# Altium schematic sheet WallBaseBoard.SchDoc: WallBaseBoard
size A3; Author: eldar6776@hotmail.com; DrawnBy: Eldar Dedic; Organization: I-MEDIA GROUP d.o.o.; Address1: Osman Topal Paše 18; Address2: 71000 Sarajevo; Address3: Federacija BiH; Address4: Bosna i Hercegovina; DocumentNumber: DE-030426; Revision: 001; SheetNumber: 1; SheetTotal: 1; SPICEModelCacheBVBUIEPD: <root> / <DocumentId>BVBUIEPD</DocumentId> / </root>
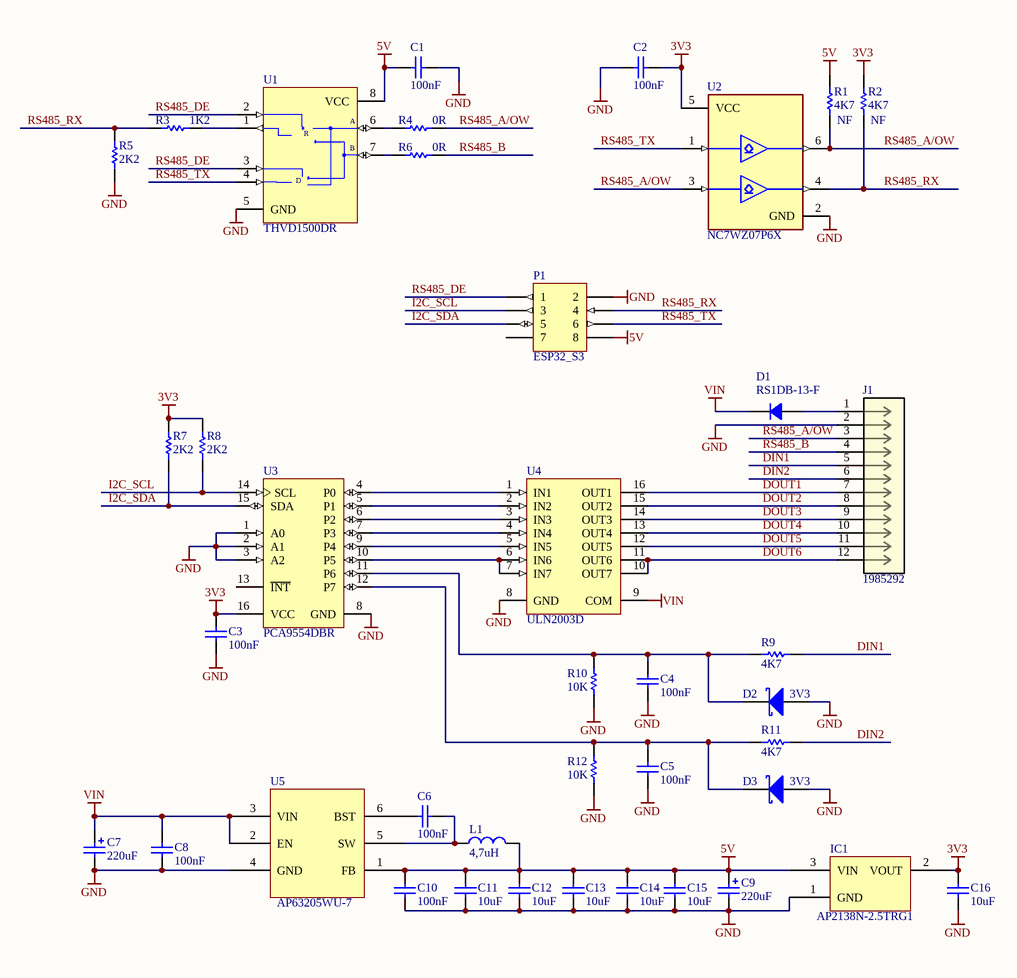
[diagram p0: WallBaseBoard.SchDoc]

## Parts
C1  100nF  [0603]
C2  100nF  [0603]
C3  100nF  [0603]
C4  100nF  [0603]
C5  100nF  [0603]
C6  100nF  [0603]
C7  220uF  [SMD,D8xL10.2mm]
C8  100nF  [0603]
C9  value 220uF  [SMD,D6.3xL7.7mm Aluminum Electrolytic Capacitors]  (hidden comment: ROQANG VT1C221M0607_1)
C10  100nF  [0603]
C11  value 10uF  [0805]  (hidden comment: 4u7)
C12  value 10uF  [0805]  (hidden comment: 4u7)
C13  value 10uF  [0805]  (hidden comment: 4u7)
C14  value 10uF  [0805]  (hidden comment: 4u7)
C15  value 10uF  [0805]  (hidden comment: 4u7)
C16  value 10uF  [0805]  (hidden comment: 4u7)
D1  RS1DB-13-F  [DO214AA SMB]
D2  3V3  [SOD323]
D3  3V3  [SOD323]
IC1  AP2138N-2.5TRG1  [DIODES SOT-23-3 N]
J1  1985292  [CONN_1985292_PXC]
L1  value 4,7uH  [XRNR4030-4.7uH/M]  (hidden comment: Inductor)
P1  ESP32_S3  [HDR2X4]
R1  NF  value 4K7  [ERA-0603]
R2  NF  value 4K7  [ERA-0603]
R3  value 1K2  [ERA-0603]  (hidden comment: 10K)
R4  value 0R  [ERA-0603]  (hidden comment: 10K)
R5  value 2K2  [ERA-0603]  (hidden comment: 10K)
R6  value 0R  [ERA-0603]  (hidden comment: 10K)
R7  value 2K2  [ERA-0603]  (hidden comment: 10K)
R8  value 2K2  [ERA-0603]  (hidden comment: 10K)
R9  value 4K7  [ERA-0603]  (hidden comment: 10K)
R10  10K  [ERA-0603]
R11  value 4K7  [ERA-0603]  (hidden comment: 10K)
R12  10K  [ERA-0603]
U1  THVD1500DR  [NSO8_N]
U2  NC7WZ07P6X  [FP-419AD-01-MFG]
U3  PCA9554DBR  [SSOP-16]
U4  ULN2003D  [SO16_N]
U5  AP63205WU-7  [TSOT-26]

## Nets
3V3: C2.1 C3.2 C16.2 IC1.2(VOUT) R2.2 R7.2 R8.2 U2.5(VCC) U3.16(VCC)
5V: C1.2 C9.1 C10.2 C11.2 C12.2 C13.2 C14.2 C15.2 IC1.3(VIN) L1.1 P1.8 R1.2 U1.8(VCC) U5.1(FB)
GND: C1.1 C2.2 C3.1 C4.1 C5.1 C7.2 C8.1 C9.2 C10.1 C11.1 C12.1 C13.1 C14.1 C15.1 C16.1 D2.2(A) D3.2(A) IC1.1(GND) J1.2 P1.2 R5.1 R10.1 R12.1 U1.5(GND) U2.2(GND) U3.1(A0) U3.2(A1) U3.3(A2) U3.8(GND) U4.8(GND) U5.4(GND)
VIN: C7.1 C8.2 D1.2 U4.9(COM) U5.2(EN) U5.3(VIN)
DIN1: J1.5 R9.1
DIN2: J1.6 R11.1
DOUT1: J1.7 U4.16(OUT1)
DOUT2: J1.8 U4.15(OUT2)
DOUT3: J1.9 U4.14(OUT3)
DOUT4: J1.10 U4.13(OUT4)
DOUT5: J1.11 U4.12(OUT5)
DOUT6: J1.12 U4.10(OUT7) U4.11(OUT6)
I2C_SCL: P1.3 R8.1 U3.14(SCL)
I2C_SDA: P1.5 R7.1 U3.15(SDA)
RS485_A/OW: J1.3 R1.1 R4.2 U2.3(A2) U2.6(Y1)
RS485_B: J1.4 R6.2
RS485_DE: P1.1 U1.2(~{RE}) U1.3(DE)
RS485_RX: P1.4 R2.1 R3.1 R5.2 U2.4(Y2)
RS485_TX: P1.6 U1.4(DI) U2.1(A1)
NetC4_2: C4.2 D2.1(K) R9.2 R10.2 U3.11(P6)
NetC5_2: C5.2 D3.1(K) R11.2 R12.2 U3.12(P7)
NetC6_1: C6.1 U5.6(BST)
NetC6_2: C6.2 L1.2 U5.5(SW)
NetD1_1: D1.1 J1.1
NetR3_2: R3.2 U1.1(RO)
NetR4_1: R4.1 U1.6(A)
NetR6_1: R6.1 U1.7(B)
NetU3_4: U3.4(P0) U4.1(IN1)
NetU3_5: U3.5(P1) U4.2(IN2)
NetU3_6: U3.6(P2) U4.3(IN3)
NetU3_7: U3.7(P3) U4.4(IN4)
NetU3_9: U3.9(P4) U4.5(IN5)
NetU3_10: U3.10(P5) U4.6(IN6) U4.7(IN7)

Not connected (* = marked no-connect by the designer): P1 7; U3 13(~{INT})

## Notes on the sheet
- Title
- Size:
- Date:
- A3
- Number:
- Time:
- Revision:
- Sheet
- of
- File:
- (in symbol MAX485ESA) R; D

## Library data of the parts
C1-C6 C8 C10 = C0603: Ceramic Chip Capacitor - Standard; Note: Footprint corresponds to dimensions for bulk cassette packaging. This case size has tightened tolerances.; Published: 17-Jul-2002; LatestRevisionDate: 19-Mar-2004; LatestRevisionNote: Silkscreen size reduced.; DatasheetDocument: Mar-2001; PackageDocument: Mar-2001; PackageReference: 0603; Publisher: Altium Limited; Code_JEITA: 0603; Code_IPC: 1608 [0603]; ComponentLink1Description: Manufacturer Link; ComponentLink1URL: http://www.kemet.com/; ComponentLink2Description: Datasheet; ComponentLink2URL: http://www.kemet.com/kemet/web/homepage/kechome.nsf/vapubfilesname/F3102TA.pdf/$file/F3102TA.pdf; Value: 100nF
C7 = ROQANG VT1V221M0810: 220uF 35V 195mA@120Hz ±20% SMD,D8xL10.2mm Aluminum Electrolytic Capacitors - SMD ROHS; Note: Refer to Manufacturer's Data Sheets for other lead formations; DrillSize: Nominal, Rounded To The Nearest 0.1mm; Published: 19-Mar-2004; DatasheetDocument: 20-Feb-2001; PackageReference: CAPPR2-5X11; Publisher: Altium Limited; ComponentLink1Description: Manufacturer Link; ComponentLink1URL: http://www.vishay.com/; ComponentLink2Description: Datasheet; ComponentLink2URL: http://www.vishay.com/docs/25014/eka.pdf; Value: 220uF
C9 = ROQANG VT1C221M0607_1: 220uF 16V 110mA@120Hz ±20% SMD,D6.3xL7.7mm Aluminum Electrolytic Capacitors - SMD ROHS; Note: Refer to Manufacturer's Data Sheets for other lead formations; DrillSize: Nominal, Rounded To The Nearest 0.1mm; Published: 19-Mar-2004; DatasheetDocument: 20-Feb-2001; PackageReference: CAPPR2-5X11; Publisher: Altium Limited; ComponentLink1Description: Manufacturer Link; ComponentLink1URL: http://www.vishay.com/; ComponentLink2Description: Datasheet; ComponentLink2URL: http://www.vishay.com/docs/25014/eka.pdf
C11-C16 = C0805: Ceramic Chip Capacitor - Standard; Note: Footprint corresponds to dimensions for bulk cassette packaging. This case size has tightened tolerances.; Published: 17-Jul-2002; LatestRevisionDate: 19-Mar-2004; LatestRevisionNote: Silkscreen size reduced.; DatasheetDocument: Mar-2001; PackageDocument: Mar-2001; PackageReference: 0805; Publisher: Altium Limited; Code_JEITA: 0805; Code_IPC: 2012[0805]; ComponentLink1Description: Manufacturer Link; ComponentLink1URL: http://www.kemet.com/; ComponentLink2Description: Datasheet; ComponentLink2URL: http://www.kemet.com/kemet/web/homepage/kechome.nsf/vapubfilesname/F3102TA.pdf/$file/F3102TA.pdf
D1 = RS1DB-13-F: DIODE STANDARD 200V 1A SMB; Manufacturer: Diodes Incorporated; Capacitance @ Vr, F: 15pF @ 4V, 1MHz; Current - Reverse Leakage @ Vr: 5 µA @ 200 V; Reverse Recovery Time (trr): 150 ns; Speed: Fast Recovery =< 500ns, > 200mA (Io); Voltage - Forward (Vf) (Max) @ If: 1.3 V @ 1 A; Part Number: RS1DB-13-F; ComponentLink1Description: Datasheet; ComponentLink1URL: https://www.diodes.com/assets/Datasheets/ds15002.pdf; ComponentLink2Description: DigiKey Link; ComponentLink2URL: https://www.digikey.com/en/products/detail/diodes-incorporated/RS1DB-13-F/814459; Current - Average Rectified (Io): 1A; Diode Type: Standard; LastUpdated: 3. 4. 2026. 20:33:12; Lifecycle Status: Active; Minimum Order: 1; Mounting Type: Surface Mount; Operating Temperature - Junction: -65°C ~ 150°C; Package / Case: DO-214AA, SMB; Packaging: TapeAndReel; PartId: 28; Part Status: Active; Price: 0.06; Series: -; Supplier 1: DigiKey; Supplier Part Number 1: RS1DB-FDICT-ND; Supplier Device Package: SMB; Voltage - DC Reverse (Vr) (Max): 200 V
D2 D3 = 1PS76SB10: Schottky Barrier Diode; Published: 17-Sep-2003; LatestRevisionDate: 19-Mar-2004; LatestRevisionNote: Silkscreen size reduced.; DatasheetVersion: 14-Oct-1996; PackageVersion: May-1999; PackageReference: SOD323; Publisher: Altium Limited; PackageDescription: SOD-323/SC-76; 2 Leads; Body 1.7 x 1.3 mm, (LxW); ComponentLink1Description: Manufacturer Link; ComponentLink1URL: http://www.semiconductors.philips.com/; ComponentLink2Description: Datasheet; ComponentLink2URL: http://www.semiconductors.philips.com/acrobat/datasheets/1PS76SB10_2.pdf
IC1 = AP2138N-2.5TRG1: IC REG LINEAR 2.5V 250MA SOT23-3; Manufacturer: Diodes Incorporated; Current - Quiescent (Iq): 1.5 µA; Number of Regulators: 1; Output Configuration: Positive; Output Type: Fixed; Protection Features: Over Current; Voltage Dropout (Max): 1V @ 250mA; Voltage - Input (Max): 6V; Part Number: AP2138N-2.5TRG1; ComponentLink1Description: Datasheet; ComponentLink1URL: https://www.diodes.com/assets/Datasheets/AP2138-9.pdf; ComponentLink2Description: DigiKey Link; ComponentLink2URL: https://www.digikey.com/en/products/detail/diodes-incorporated/AP2138N-2-5TRG1/4470803; Current - Output: 250mA; LastUpdated: 3. 4. 2026. 21:07:40; Lifecycle Status: Active; Minimum Order: 1; Mounting Type: Surface Mount; Operating Temperature: -40°C ~ 85°C (TA); Package / Case: TO-236-3, SC-59, SOT-23-3; Packaging: TapeAndReel; Part Status: Active; Price: 0.08; Series: -; Supplier 1: DigiKey; Supplier Part Number 1: AP2138N-2.5TRG1DICT-ND; Supplier Device Package: SOT-23-3; Voltage - Output (Min/Fixed): 2.5V
J1 = 1985292: PCB terminal block, nominal current: 8 A, nom. voltage: 400 V, pitch: 3.5 mm, number of positions: 12, connection method: Push-in spring connection, mounting: Wave soldering, conductor/PCB connection direction: 45 Â°, color: green. Offset soldering legs, two-rowed; Manufacturer_Name: Phoenix Contact; Copyright: Copyright (C) 2026 Ultra Librarian. All rights reserved.; Manufacturer_Part_Number: 1985292; RefDes: RefDes; Type: Type
L1 = Inductor: 2A 4.7uH Magnetic Adhesive Inductor ±20% 2.9A SMD-2P,4x4mm Power Inductors ROHS
P1 = Header 4X2: Header, 4-Pin, Dual row; LatestRevisionDate: 17-Jul-2002; LatestRevisionNote: Re-released for DXP Platform.; Publisher: Altium Limited
R1-R12 = ERAV: Metal Film Thermosensitive Chip Resistor, 0.56 Ohm to 10k Ohm Range, 5% Tolerance, 0603 Size, 0.063 W; Note: If flow soldering, adjust pad width of PCB Footprint to 0.7 - 0.8 times the width of the resistor.; Published: 17-Dec-2003; LatestRevisionDate: 19-Mar-2004; LatestRevisionNote: Silkscreen size reduced.; PackageDocument: Mar-2003; PackageReference: ERA-0603; Publisher: Altium Limited; Code_IPC: 1608 [0603]; ComponentLink1Description: Manufacturer Link; ComponentLink1URL: http://www.panasonic.com/industrial/components/resistive_products.htm; ComponentLink2Description: Datasheet; ComponentLink2URL: http://www.panasonic.com/industrial/components/pdf/AOF0000CE1.pdf
  R10 R12: Value: 10K
U1 = MAX485ESA: Low-Power, Slew-Rate-Limited RS-485/RS-422 Transceiver; Published: 16-Jan-2001; LatestRevisionDate: 13-Apr-2006; LatestRevisionNote: IPC-7351 Footprint Added.; DatasheetVersion: Feb-1996; PackageReference: NSO8; Publisher: Altium Limited; PackageDescription: 8-Pin Small Outline Integrated Circuit 1.27 mm Pitch; Code_JEDEC: MS-012-AA; Code_IPC: SOIC127P600-8; ComponentLink1Description: Manufacturer Link; ComponentLink1URL: http://www.maxim-ic.com/; ComponentLink2Description: Datasheet; ComponentLink2URL: http://pdfserv.maxim-ic.com/en/ds/MAX1487-MAX491.pdf
U2 = CMP-2000-06822-2: IC BUF NON-INVERT 5.5V SC70-6; Propagation Delay: 12.6ns; Max Power Dissipation: 180mW; High Level Output Current: 32mA; Number of Outputs: 2; Number of Bits per Element: 1; Polarity: Non-Inverting; Max Supply Current: 24mA; Turn-On Delay Time: 11.5ns; Logic Function: Buffer; Min Supply Voltage: 1.65V; Quiescent Current: 1uA; REACH SVHC: No SVHC; Lead Free: Lead Free; Packaging: Tape and Reel; Low Level Output Current: 32mA; Number of Channels: 2; Number of Output Lines: 2; Number of Bits: 2; Min Operating Temperature: -40°C; Radiation Hardening: No; Number of Elements: 2; Number of Pins: 6; Number of Inputs: 2; Max Supply Voltage: 5.5V; Package Quantity: 1; Termination: SMD/SMT; Number of Input Lines: 2; Number of Circuits: 2; Weight: 0.028g; Max Operating Temperature: 85°C; Case/Package: SC; Length: 2mm; Width: 1.25mm; Mount: Surface Mount; Height: 1mm
U3 = CMP-0314-00200-2: Remote 8-Bit I2C and SMBus I/O Expander with Interrupt Output and Configuration Registers, 8 Outputs, 2.3 to 5.5 V, -40 to 85 degC, 16-pin SSOP (DB), Green (RoHS & no Sb/Br); Manufacturer: Texas Instruments; Max Frequency(kHz): 400; 5V Tolerant I/O: Yes; VCC(Max)(V): 5.5; No. of Outputs: 8; Technology Family: PCA; SubFamily: I2C IO Expander; I2C Address: 0100 xxx; VCC(Min)(V): 2.3; PackageDescription: 16-Pin Plastic Small Outline Package, 6.2 x 5.3 mm Body, 0.65 mm Pitch; Code_JEDEC: MO-150; ComponentLink1URL: http://www.ti.com/general/docs/lit/getliterature.tsp?genericPartNumber=PCA9554&fileType=pdf; Push-Pull I/O Type: Yes; Eco-Plan: Green (RoHS & no Sb/Br); PackageReference: DB0016A; PackageVersion: revE, Dec-2001; fSCLK(Max)(MHz): 400; DatasheetVersion: SCPS128B; Configuration Registers: Yes; ComponentLink1Description: Datasheet; # of I/Os: 8; Vcc range(V): 2.3 to 5.5; Interrupt Output: Yes; ComponentLink2URL: http://www.ti.com/litv/pdf/msso002e; PartNumber: PCA9554DBR; Mounting Technology: Surface Mount; ComponentLink2Description: Package Specification
U4 = ULN2003D: Seven Darlington Array; Published: 8-Jun-2000; LatestRevisionDate: 13-Apr-2006; LatestRevisionNote: IPC-7351 Footprint Added.; DatasheetVersion: Sep-1998; PackageVersion: May-1998; PackageReference: SO16; Publisher: Altium Limited; PackageDescription: 16-Pin Small Outline Integrated Circuit 1.27 mm Pitch; Code_IPC: SOIC127P600-16; ComponentLink1Description: Manufacturer Link; ComponentLink1URL: http://www.st.com/; ComponentLink2Description: Datasheet; ComponentLink2URL: http://www.st.com/stonline/products/literature/ds/5279/uln2001.pdf
U5 = AP63200: 2A synchronous  buck converter